# EAGLE design zero_3_2b4_c (EAGLE 4.16)
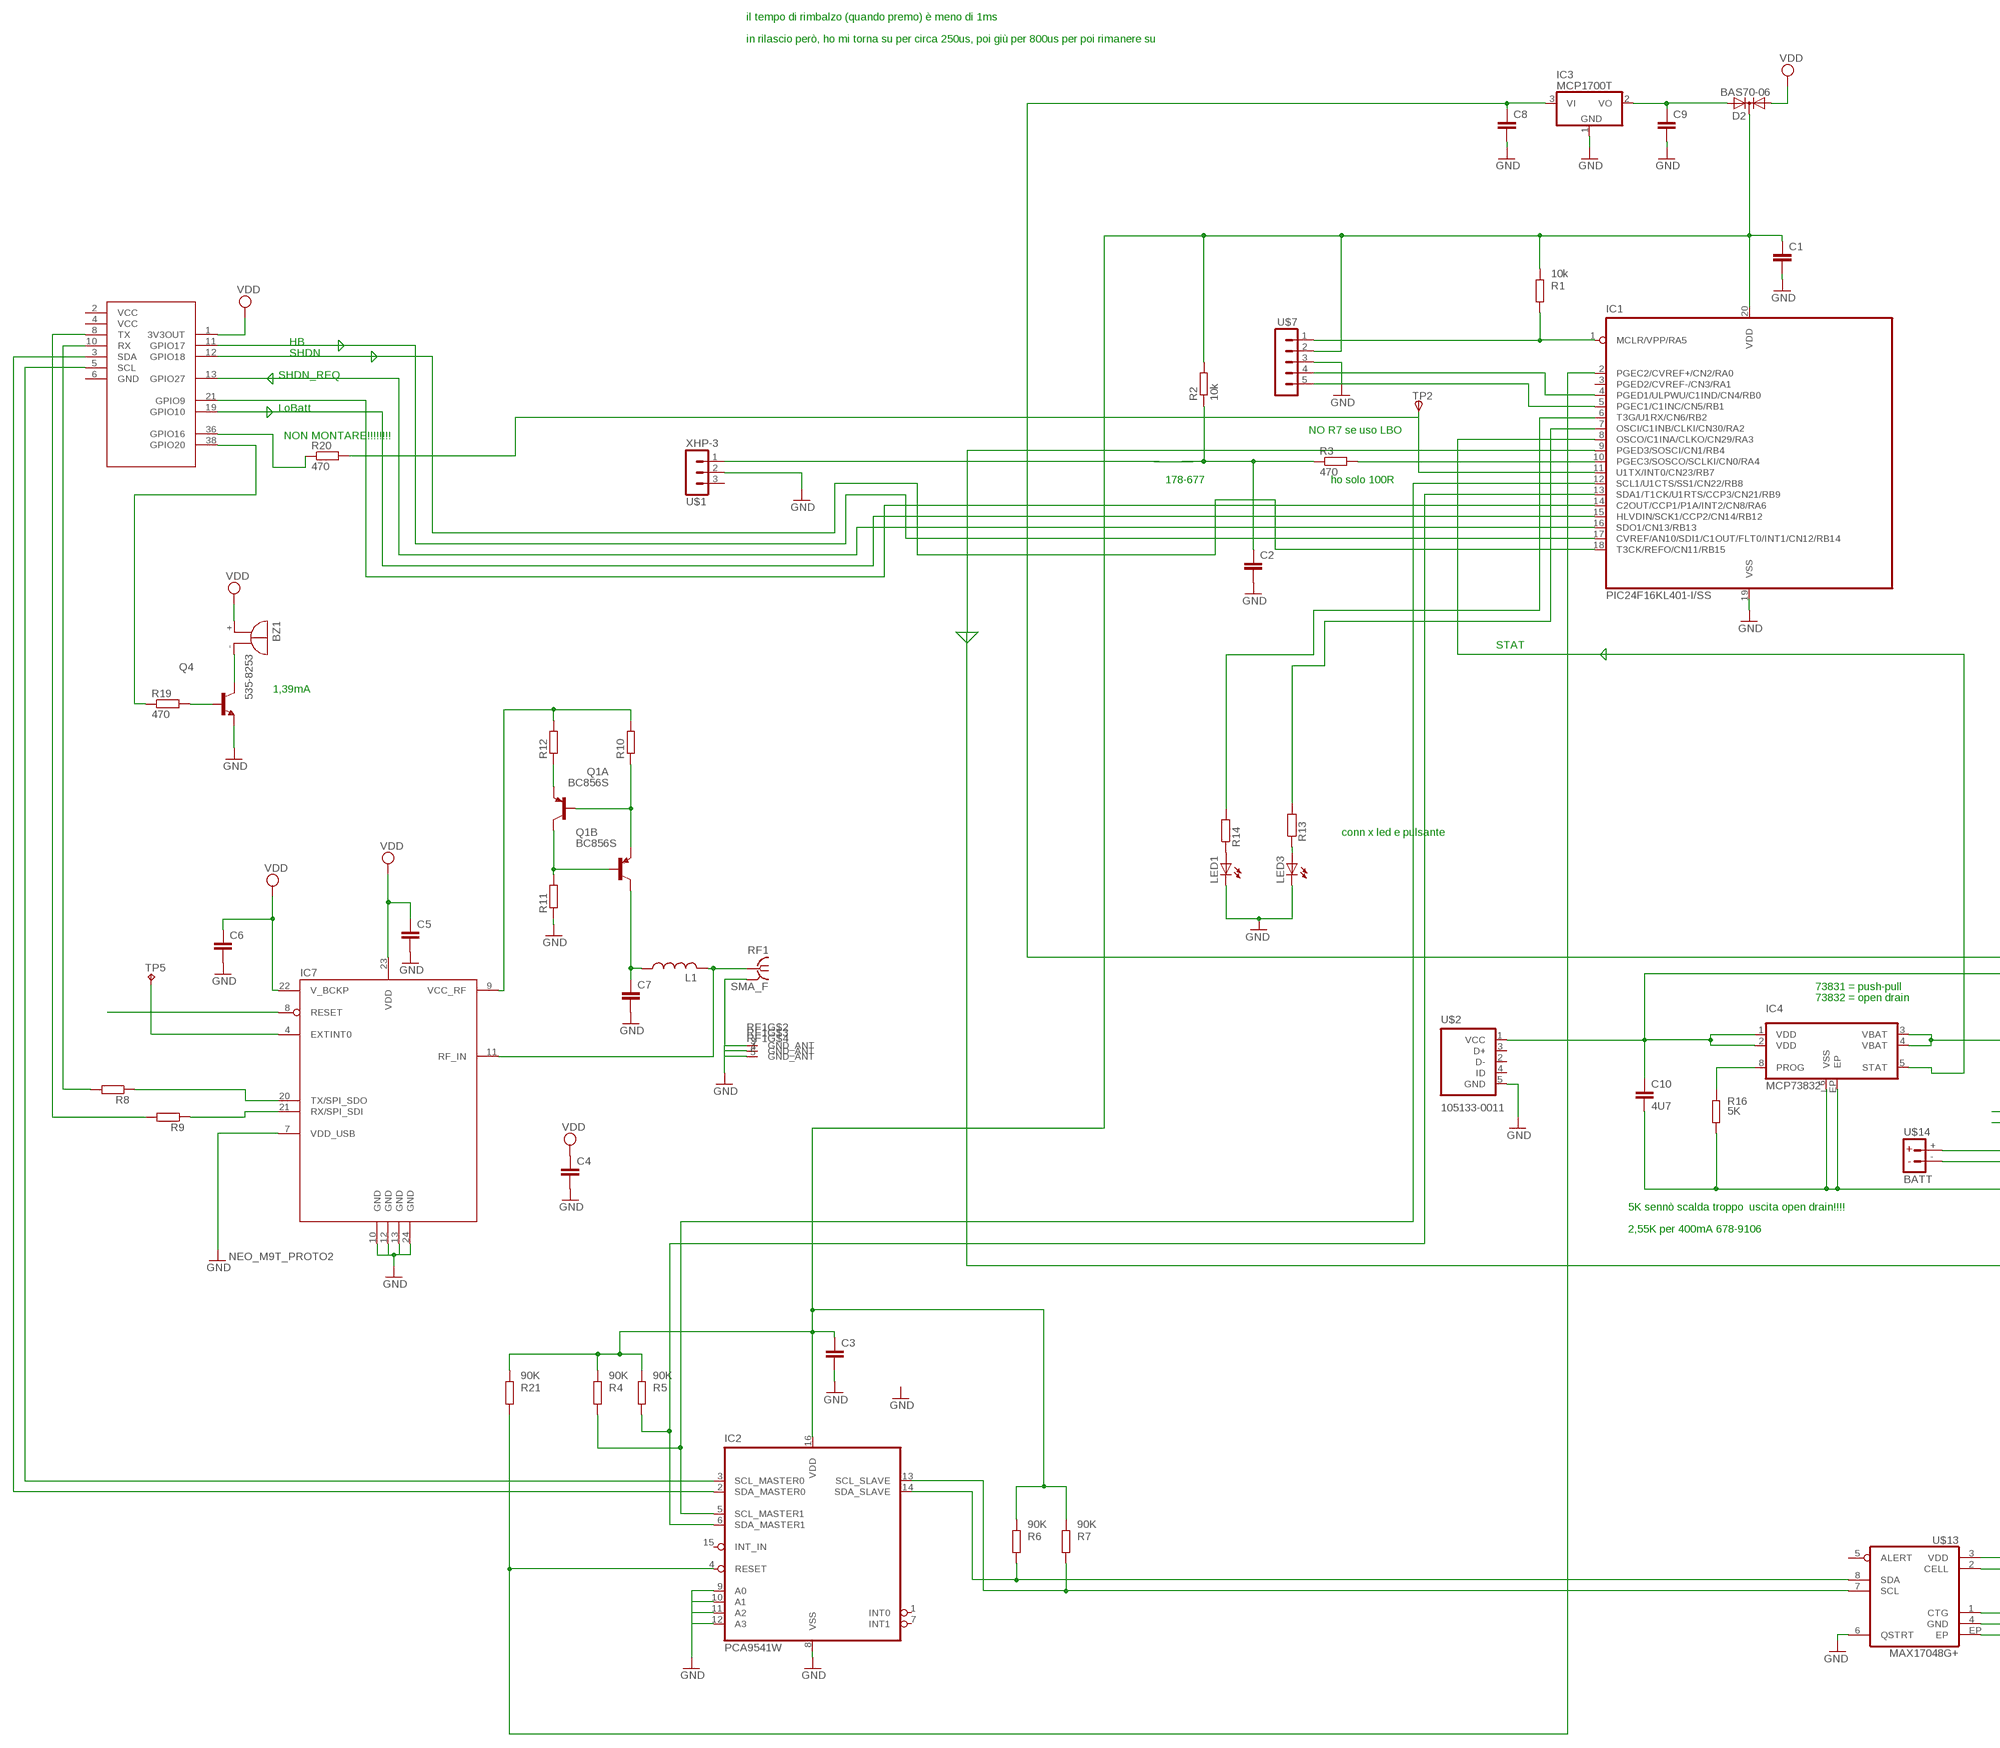
[diagram p0: schematic, sheet 1, part 1 of 2]
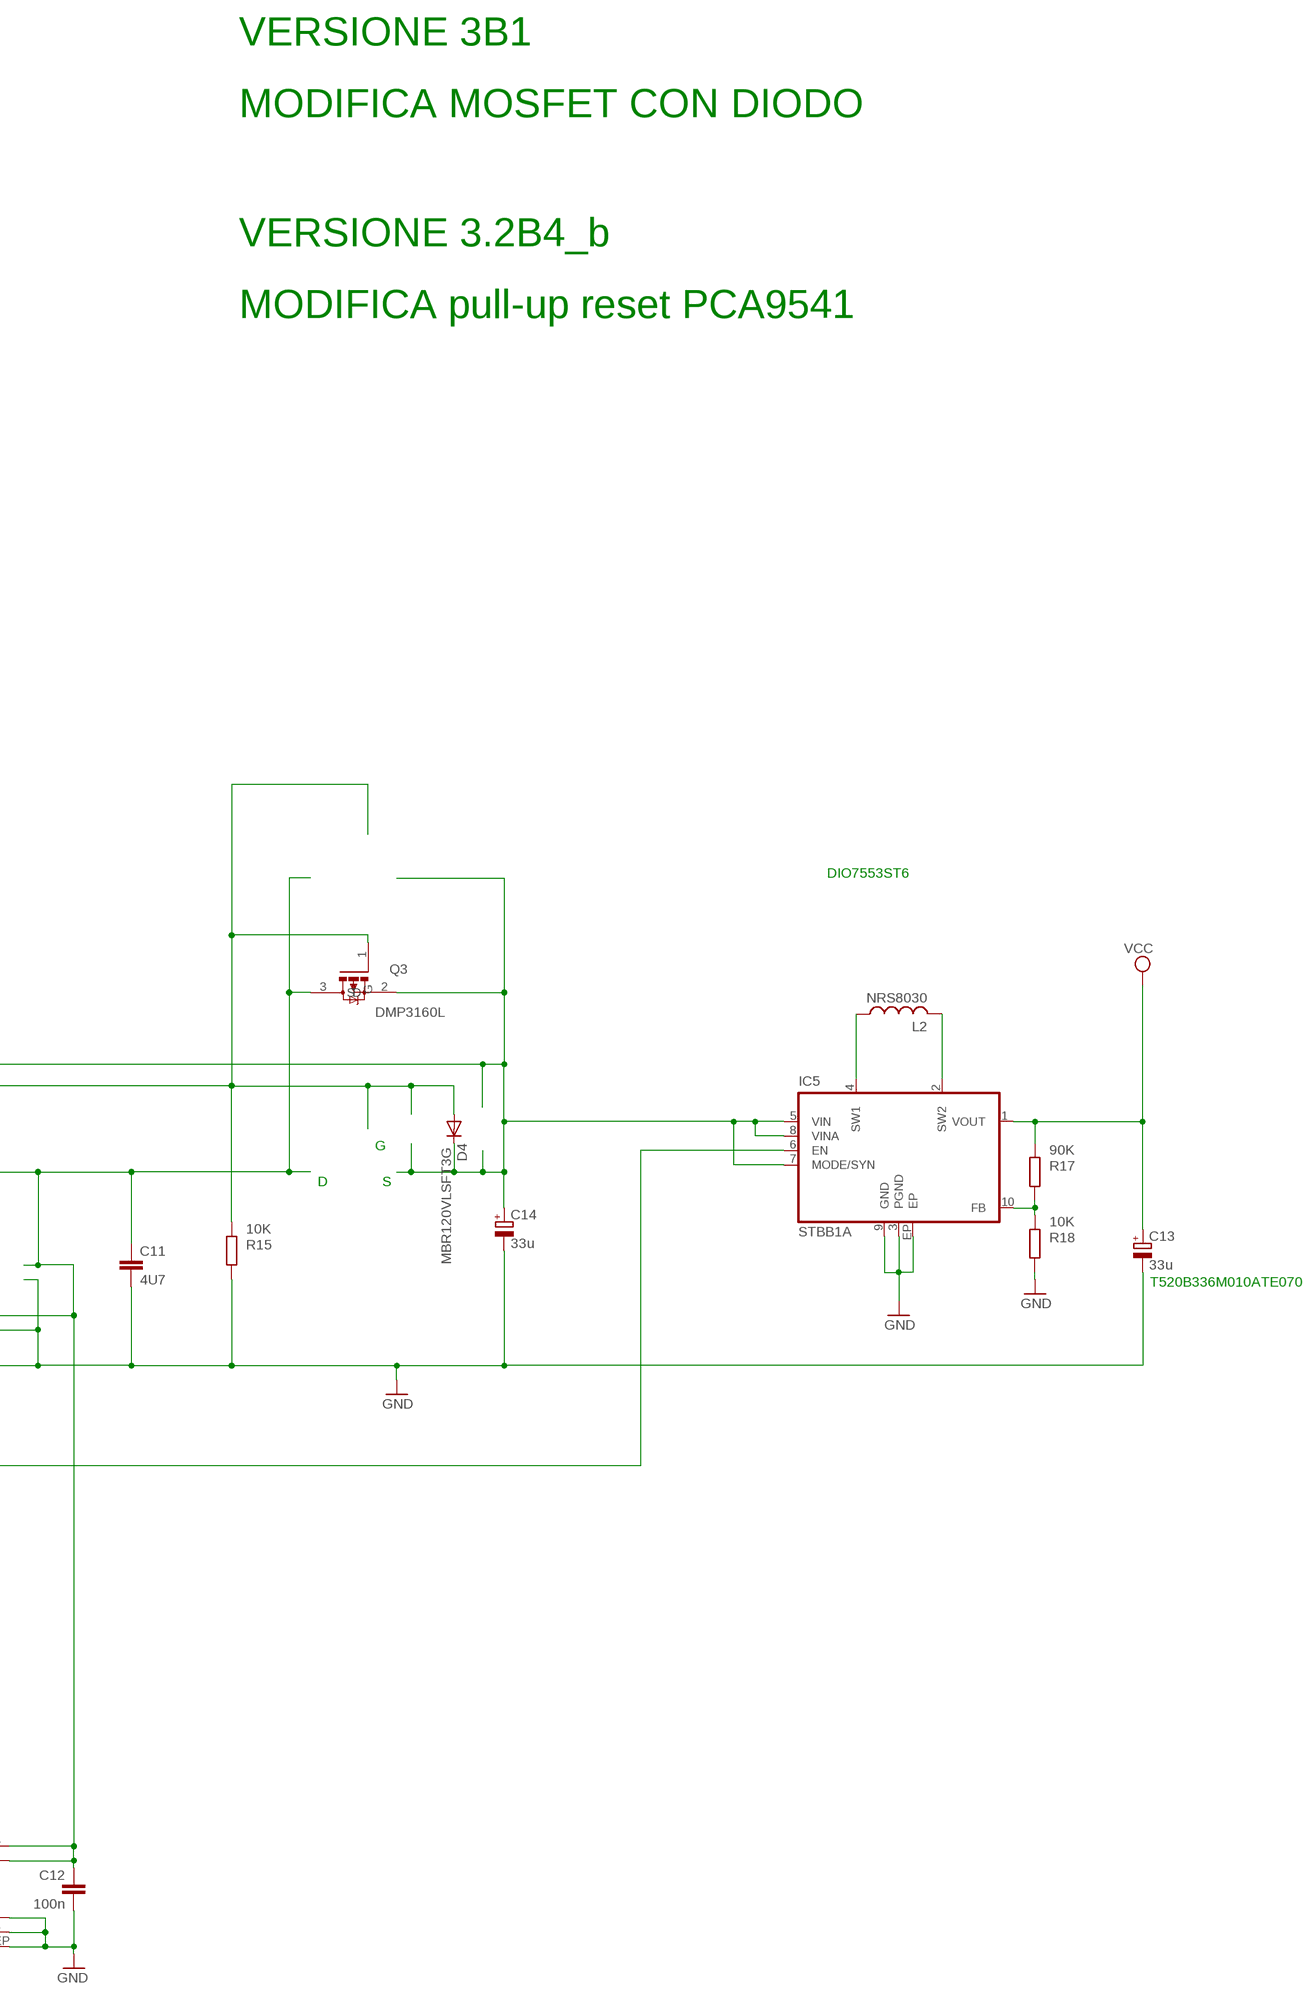
[diagram p1: schematic, sheet 1, part 2 of 2]

## Parts
BZ1  535-8253  [535-8253]
C1  C-EUC0402  [C0402]
C2  C-EUC0402  [C0402]
C3  C-EUC0402  [C0402]
C4  C-EUC1206  [C1206]
C5  C-EUC0402  [C0402]
C6  C-EUC0402  [C0402]
C7  C-EUC0402  [C0402]
C8  C-EUC0402  [C0402]
C9  C-EUC0402  [C0402]
C10  4U7  C-EUC0805  [C0805]
C11  4U7  C-EUC0805  [C0805]
C12  100n  C-EUC0402  [C0402]
C13  33u  CPOL-EUB/3528-21R  [B/3528-21R]
C14  33u  CPOL-EUB/3528-21R  [B/3528-21R]
D2  BAS70-06  [SOT23]
D4  MBR120VLSFT3G  DIODE-SOD123  [SOD123]
IC1  PIC24F16KL401-I/SS  PIC24F04KL101-I/SS  [SSOP20]
IC2  PCA9541W  [TSSOP16]
IC3  MCP1700T  [SOT23]
IC4  MCP73832_  MCP73831_  [DFN8]
IC5  STBB1A  [DFN-10]
IC7  NEO_M9T_PROTO2  [M8T_PROTO_3]
L1  L-US0402  [C0402]
L2  NRS8030  [NRS8030]
LED1  LEDPCB  [LED3MM_PCB]
LED3  LEDPCB  [LED3MM_PCB]
Q1  BC856S  [SOT-363]
Q3  DMP3160L  [SOT23]
Q4  -NPN-SOT23-EBC  [SOT23-EBC]
R1  10k  R-EU_R0402  [R0402]
R2  10k  R-EU_R0402  [R0402]
R3  470  R-EU_R0402  [R0402]
R4  90K  R-EU_R0402  [R0402]
R5  90K  R-EU_R0402  [R0402]
R6  90K  R-EU_R0402  [R0402]
R7  90K  R-EU_R0402  [R0402]
R8  R-EU_R0402  [R0402]
R9  R-EU_R0402  [R0402]
R10  R-EU_R0402  [R0402]
R11  R-EU_R0402  [R0402]
R12  R-EU_R0402  [R0402]
R13  R-EU_R0402  [R0402]
R14  R-EU_R0402  [R0402]
R15  10K  R-EU_R0402  [R0402]
R16  5K  R-EU_R0402  [R0402]
R17  90K  R-EU_R0402  [R0402]
R18  10K  R-EU_R0402  [R0402]
R19  470  R-EU_R0402  [R0402]
R20  470  R-EU_R0402  [R0402]
R21  90K  R-EU_R0402  [R0402]
RF1  SMA_F  [5-1814400-1]
TP2  TPSB1,27  [B1,27]
TP5  TPB1,27  [B1,27]
U$1  XHP-3  [B3B-XH]
U$2  105133-0011  [105133-0011]
U$7  MA05-1  [281695-5]
U$13  MAX17048G+  [TDFN8EP]
U$14  BATT  [XH]
ZW5  ZERO_7  [ZERO_7]

## Nets
GND: C1.2 C2.2 C3.2 C4.2 C5.2 C6.2 C7.2 C8.2 C9.2 C10.2 C11.2 C12.2 C13.- C14.- IC1.19(VSS) IC2.8(VSS) IC2.9(A0) IC2.10(A1) IC2.11(A2) IC2.12(A3) IC3.1(GND) IC4.6(VSS) IC4.EP IC5.3(PGND) IC5.9(GND) IC5.EP IC7.7(VDD_USB) IC7.10(GND) IC7.12(GND) IC7.13(GND) IC7.24(GND) LED1.K(C) LED3.K(C) Q4.E R11.1 R15.2 R16.2 R18.2 RF1.2(GND_ANT) RF1.3(GND_ANT) RF1.4(GND_ANT) RF1.5(GND_ANT) U$1.2 U$2.5(GND) U$7.3 U$13.1(CTG) U$13.4(GND) U$13.6(QSTRT) U$13.EP U$14.-
N$1: IC2.14(SDA_SLAVE) R6.2 U$13.8(SDA)
N$2: C8.1 C14.+ D4.C IC3.3(VI) IC5.5(VIN) IC5.7(MODE/SYN) IC5.8(VINA) Q3.2(S)
N$3: IC1.2(PGEC2/CVREF+/CN2/RA0) IC2.4(RESET) R21.2
N$4: R20.1 ZW5.36(GPIO16)
N$5: Q4.B R19.2
N$6: IC2.2(SDA_MASTER0) ZW5.3(SDA)
N$7: C9.1 D2.2(A2) IC3.2(VO)
N$8: IC1.4(PGED1/ULPWU/C1IND/CN4/RB0) U$7.4
N$10: IC2.3(SCL_MASTER0) ZW5.5(SCL)
N$11: IC1.11(U1TX/INT0/CN23/RB7) R20.2 TP2.PP
N$13: IC2.13(SCL_SLAVE) R7.2 U$13.7(SCL)
N$14: IC1.9(PGED3/SOSCI/CN1/RB4) IC5.6(EN)
N$15: IC1.1(MCLR/VPP/RA5) R1.2 U$7.1
N$17: R19.1 ZW5.38(GPIO20)
N$18: BZ1.- Q4.C
N$19: IC1.5(PGEC1/C1INC/CN5/RB1) U$7.5
N$23: IC1.17(CVREF/AN10/SDI1/C1OUT/FLT0/INT1/CN12/RB14) ZW5.11(GPIO17)
N$24: IC1.14(C2OUT/CCP1/P1A/INT2/CN8/RA6) ZW5.21(GPIO9)
N$25: IC1.15(HLVDIN/SCK1/CCP2/CN14/RB12) ZW5.19(GPIO10)
N$26: IC1.10(PGEC3/SOSCO/SCLKI/CN0/RA4) R3.2
N$27: IC1.12(SCL1/U1CTS/SS1/CN22/RB8) IC2.5(SCL_MASTER1) R4.2
N$28: C2.1 R2.1 R3.1 U$1.1
N$31: C11.1 C12.1 IC4.3(VBAT) IC4.4(VBAT) Q3.3(D) U$13.2(CELL) U$13.3(VDD) U$14.+
N$36: LED1.A R14.1
N$37: IC1.13(SDA1/T1CK/U1RTS/CCP3/CN21/RB9) IC2.6(SDA_MASTER1) R5.2
N$38: LED3.A R13.1
N$39: C1.1 C3.1 D2.3(C) IC1.20(VDD) IC2.16(VDD) R1.1 R2.2 R4.1 R5.1 R6.1 R7.1 R21.1 U$7.2
N$40: IC1.8(OSCO/C1INA/CLKO/CN29/RA3) IC4.5(STAT)
N$41: IC1.7(OSCI/C1INB/CLKI/CN30/RA2) R13.2
N$49: IC5.10(FB) R17.2 R18.1
N$51: IC1.6(T3G/U1RX/CN6/RB2) R14.2
N$61: IC5.2(SW2) L2.2
N$62: IC5.4(SW1) L2.1
N$66: IC7.11(RF_IN) L1.2 RF1.1
N$67: C7.1 L1.1 Q1.3(B:C)
N$68: Q1.2(A:B) Q1.4(B:E) R10.1
N$69: Q1.5(B:B) Q1.6(A:C) R11.2
N$70: Q1.1(A:E) R12.1
N$71: IC7.4(EXTINT0) TP5.PP(TP)
N$72: IC7.8(RESET)
N$73: IC7.21(RX/SPI_SDI) R9.1
N$74: IC7.20(TX/SPI_SDO) R8.1
N$75: IC7.9(VCC_RF) R10.2 R12.2
N$76: R8.2 ZW5.10(RX)
N$77: R9.2 ZW5.8(TX)
N$80: IC1.16(SDO1/CN13/RB13) ZW5.13(GPIO27)
N$81: IC1.18(T3CK/REFO/CN11/RB15) ZW5.12(GPIO18)
N$82: IC4.8(PROG) R16.1
N$83: C10.1 D4.A IC4.1(VDD) IC4.2(VDD) Q3.1(G) R15.1 U$2.1(VCC)
VCC: C13.+ IC5.1(VOUT) R17.1
VDD: BZ1.+ C4.1 C5.1 C6.1 D2.1(A1) IC7.22(V_BCKP) IC7.23(VDD) ZW5.1(3V3OUT)
Unconnected: IC1.3(PGED2/CVREF-/CN3/RA1) IC2.1(INT0) IC2.7(INT1) IC2.15(INT_IN) U$1.3 U$2.2(D-) U$13.5(ALERT)

## Notes on the sheet
- il tempo di rimbalzo (quando premo) è meno di 1ms
- in rilascio però, ho mi torna su per circa 250us, poi giù per 800us per poi rimanere su
- VERSIONE 3B1
- MODIFICA MOSFET CON DIODO
- VERSIONE 3.2B4_b
- HB
- SHDN
- SHDN_REQ
- MODIFICA pull-up reset PCA9541
- LoBatt
- NO R7 se uso LBO
- NON MONTARE!!!!!!!!
- 178-677 | ho solo 100R
- STAT
- 1,39mA
- DIO7553ST6
- conn x led e pulsante
- 73831 = push-pull
- 73832 = open drain
- G
- D | S
- T520B336M010ATE070
- 5K sennò scalda troppo | uscita open drain!!!!
- 2,55K per 400mA 678-9106

## Power pins joined to a net without a drawn wire
D+: U$2.3(D+)
GND: ZW5.6(GND)
GND_ANT: U$2.S1(GND_ANT) U$2.S2(GND_ANT) U$2.S3(GND_ANT)
ID: U$2.4(ID)
VCC: ZW5.2(VCC) ZW5.4(VCC)

## Library data of the parts
BZ1 = buzzer:535-8253
C1-C12 = 000001:C-EU: CAPACITOR, European symbol
C13 C14 = 000001:CPOL-EU: POLARIZED CAPACITOR, European symbol
D2 = diode:BAS70-06: Silicon Schottky Diodes General-purpose diode for high-speed switching
D4 = diode:DIODE-: DIODE
IC1 = microchip:PIC24F04KL101
IC2 = nxp:PCA9541
IC3 = 000001:MCP1700
IC4 = microchip:MCP73831_
IC5 = st:STBB1A
IC7 = ublox:NEO_M9T_PROTO2
L1 = 000001:L-US: INDUCTOR, American symbol
L2 = Taiyo:NRS8030
LED1 LED3 = 000001:LED: LED OSRAM: - CHIPLED LG R971, LG N971, LY N971, LG Q971, LY Q971, LO R971, LY R971 LH N974, LH R974 LS Q976, LO Q976, LY Q976 LO Q996 - Hyper CHIPLED LW Q18S LB Q993, LB Q99A, LB R99A - SideLED LS A670, LO A670, LY A670, LG A670, LP A670 LB A673, LV A673, LT A673, LW A673 LH A674 LY A675 LS A676, LA A676, LO A676, LY A676, LW A676 LS A679, LY A679, LG A679 - Hyper Micro SIDELED® LS Y876, LA Y876, LO Y876, LY Y876 LT Y87S - SmartLED LW L88C, LW L88S LB L89C, LB L89S, LG L890 LS L89K, LO L89K, LY L89K LS L896, LA L896, LO L896, LY L896 - TOPLED LS T670, LO T670, LY T670, LG T670, LP T670 LSG T670, LSP T670, LSY T670, LOP T670, LYG T670 LG T671, LOG T671, LSG T671 LB T673, LV T673, LT T673, LW T673 LH T674 LS T676, LA T676, LO T676, LY T676, LB T676, LH T676, LSB T676, LW T676 LB T67C, LV T67C, LT T67C, LS T67K, LO T67K, LY T67K, LW E67C LS E67B, LA E67B, LO E67B, LY E67B, LB E67C, LV E67C, LT E67C LW T67C LS T679, LY T679, LG T679 LS T770, LO T770, LY T770, LG T770, LP T770 LB T773, LV T773, LT T773, LW T773 LH T774 LS E675, LA E675, LY E675, LS T675 LS T776, LA T776, LO T776, LY T776, LB T776 LHGB T686 LT T68C, LB T68C - Hyper Mini TOPLED® LB M676 - Mini TOPLED Santana® LG M470 LS M47K, LO M47K, LY M47K Source: http://www.osram.convergy.de/
Q1 = transistor:BC856
Q3 = zetex:DMP3160
Q4 = transistor:*-NPN-: NPN Transistror
R1-R21 = 000001:R-EU_: RESISTOR, European symbol
RF1 = te:SMA_F
TP2 = testpad:TPS: TEST PIN
TP5 = testpad:TP
U$1 = JST:XHP-3
U$2 = molex:105133-0011
U$7 = te:MA05-1
U$13 = maxim:MAX17048
U$14 = JST:BATT
ZW5 = raspberry_pi:ZERO_7

## Board
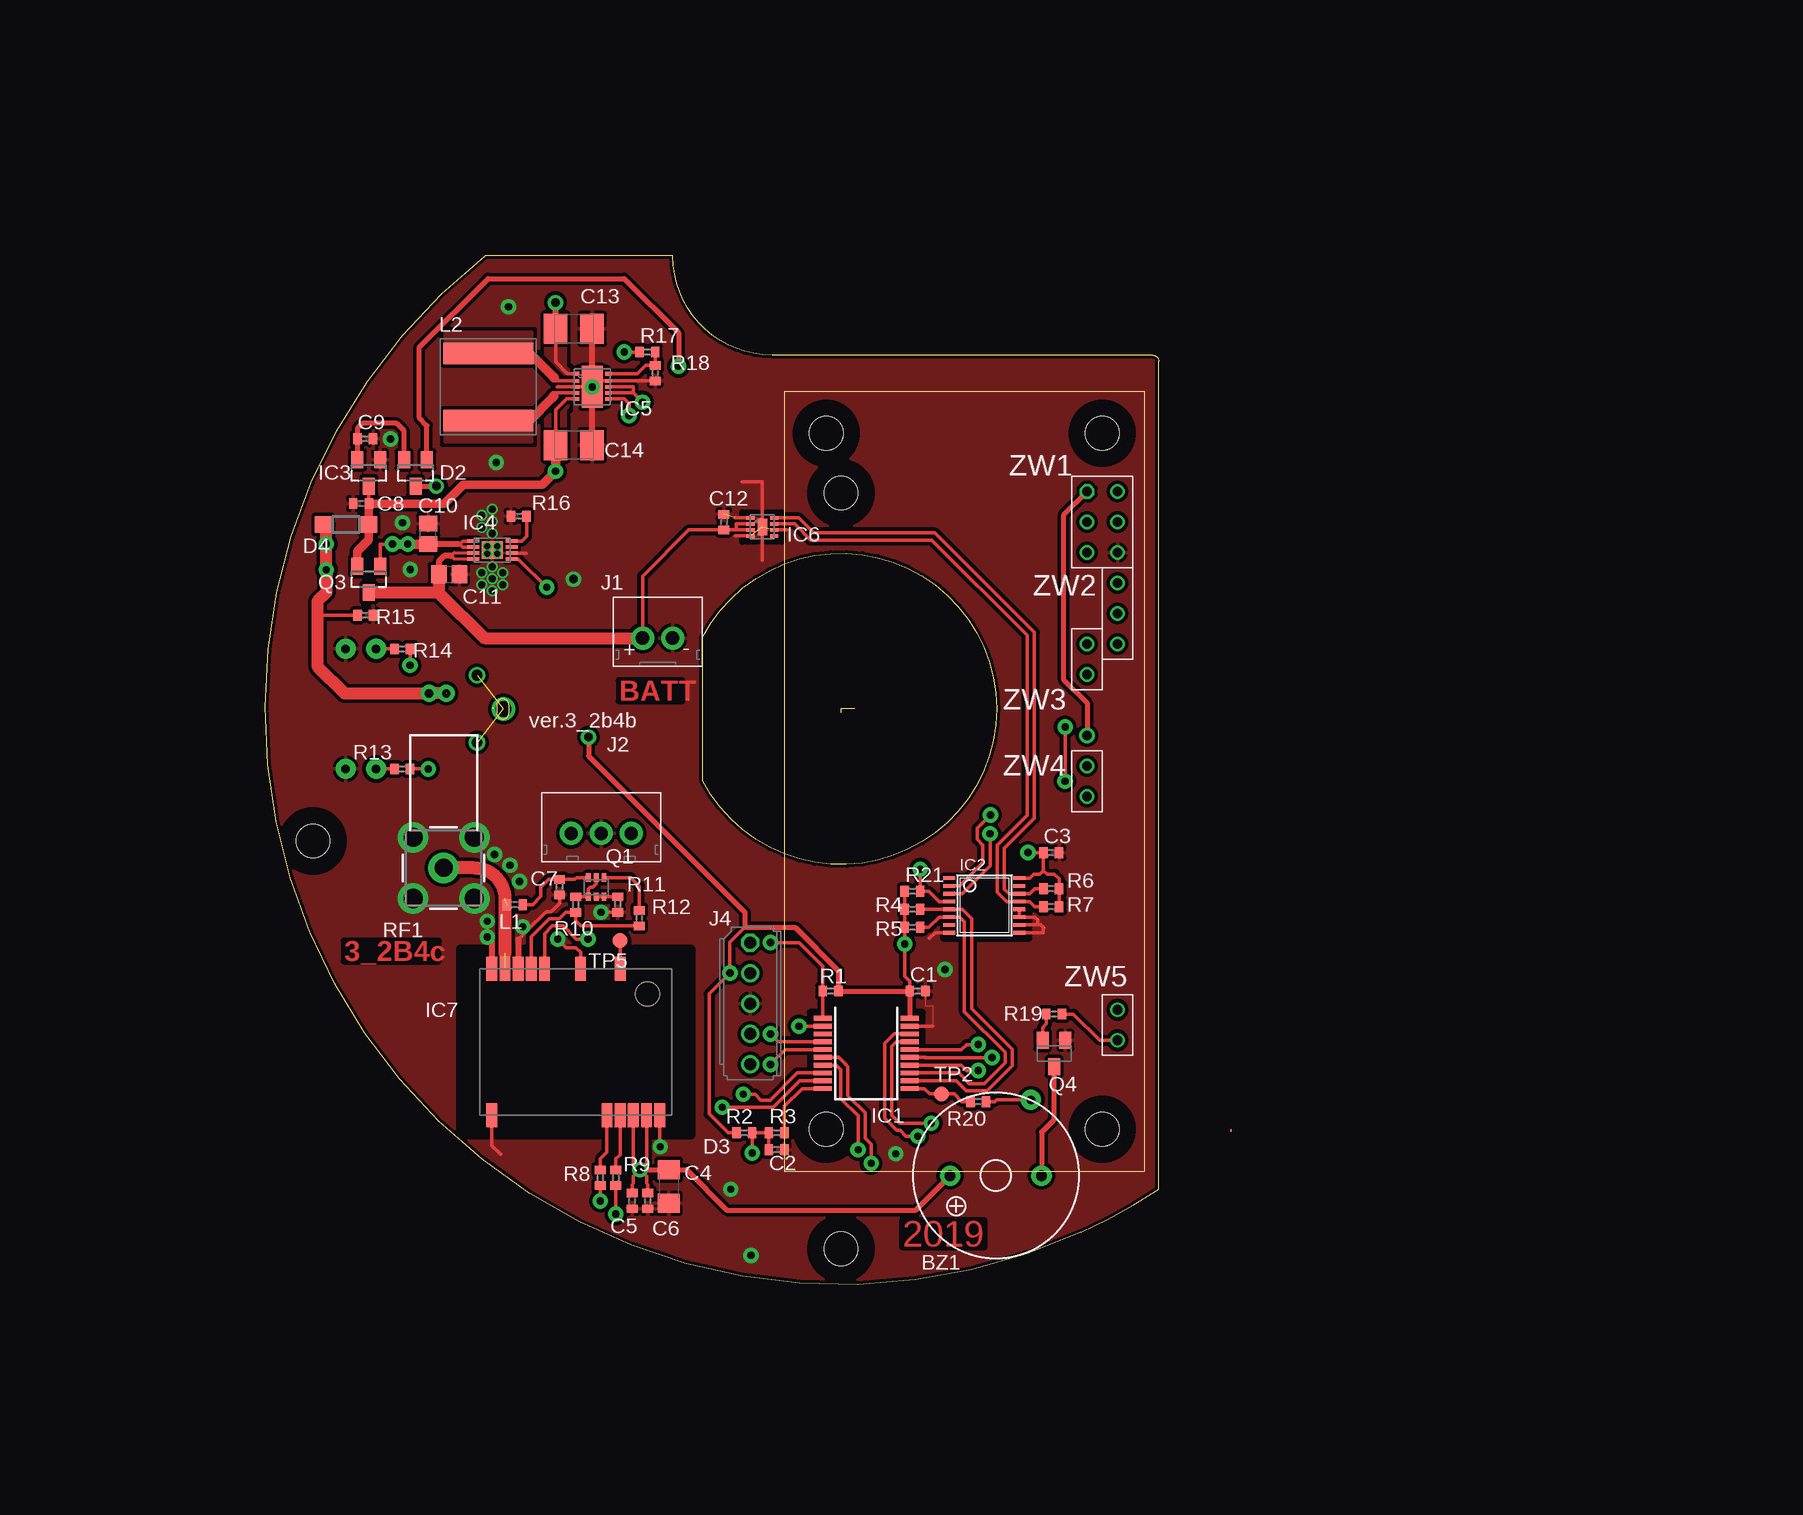
[diagram p2: board, top side]
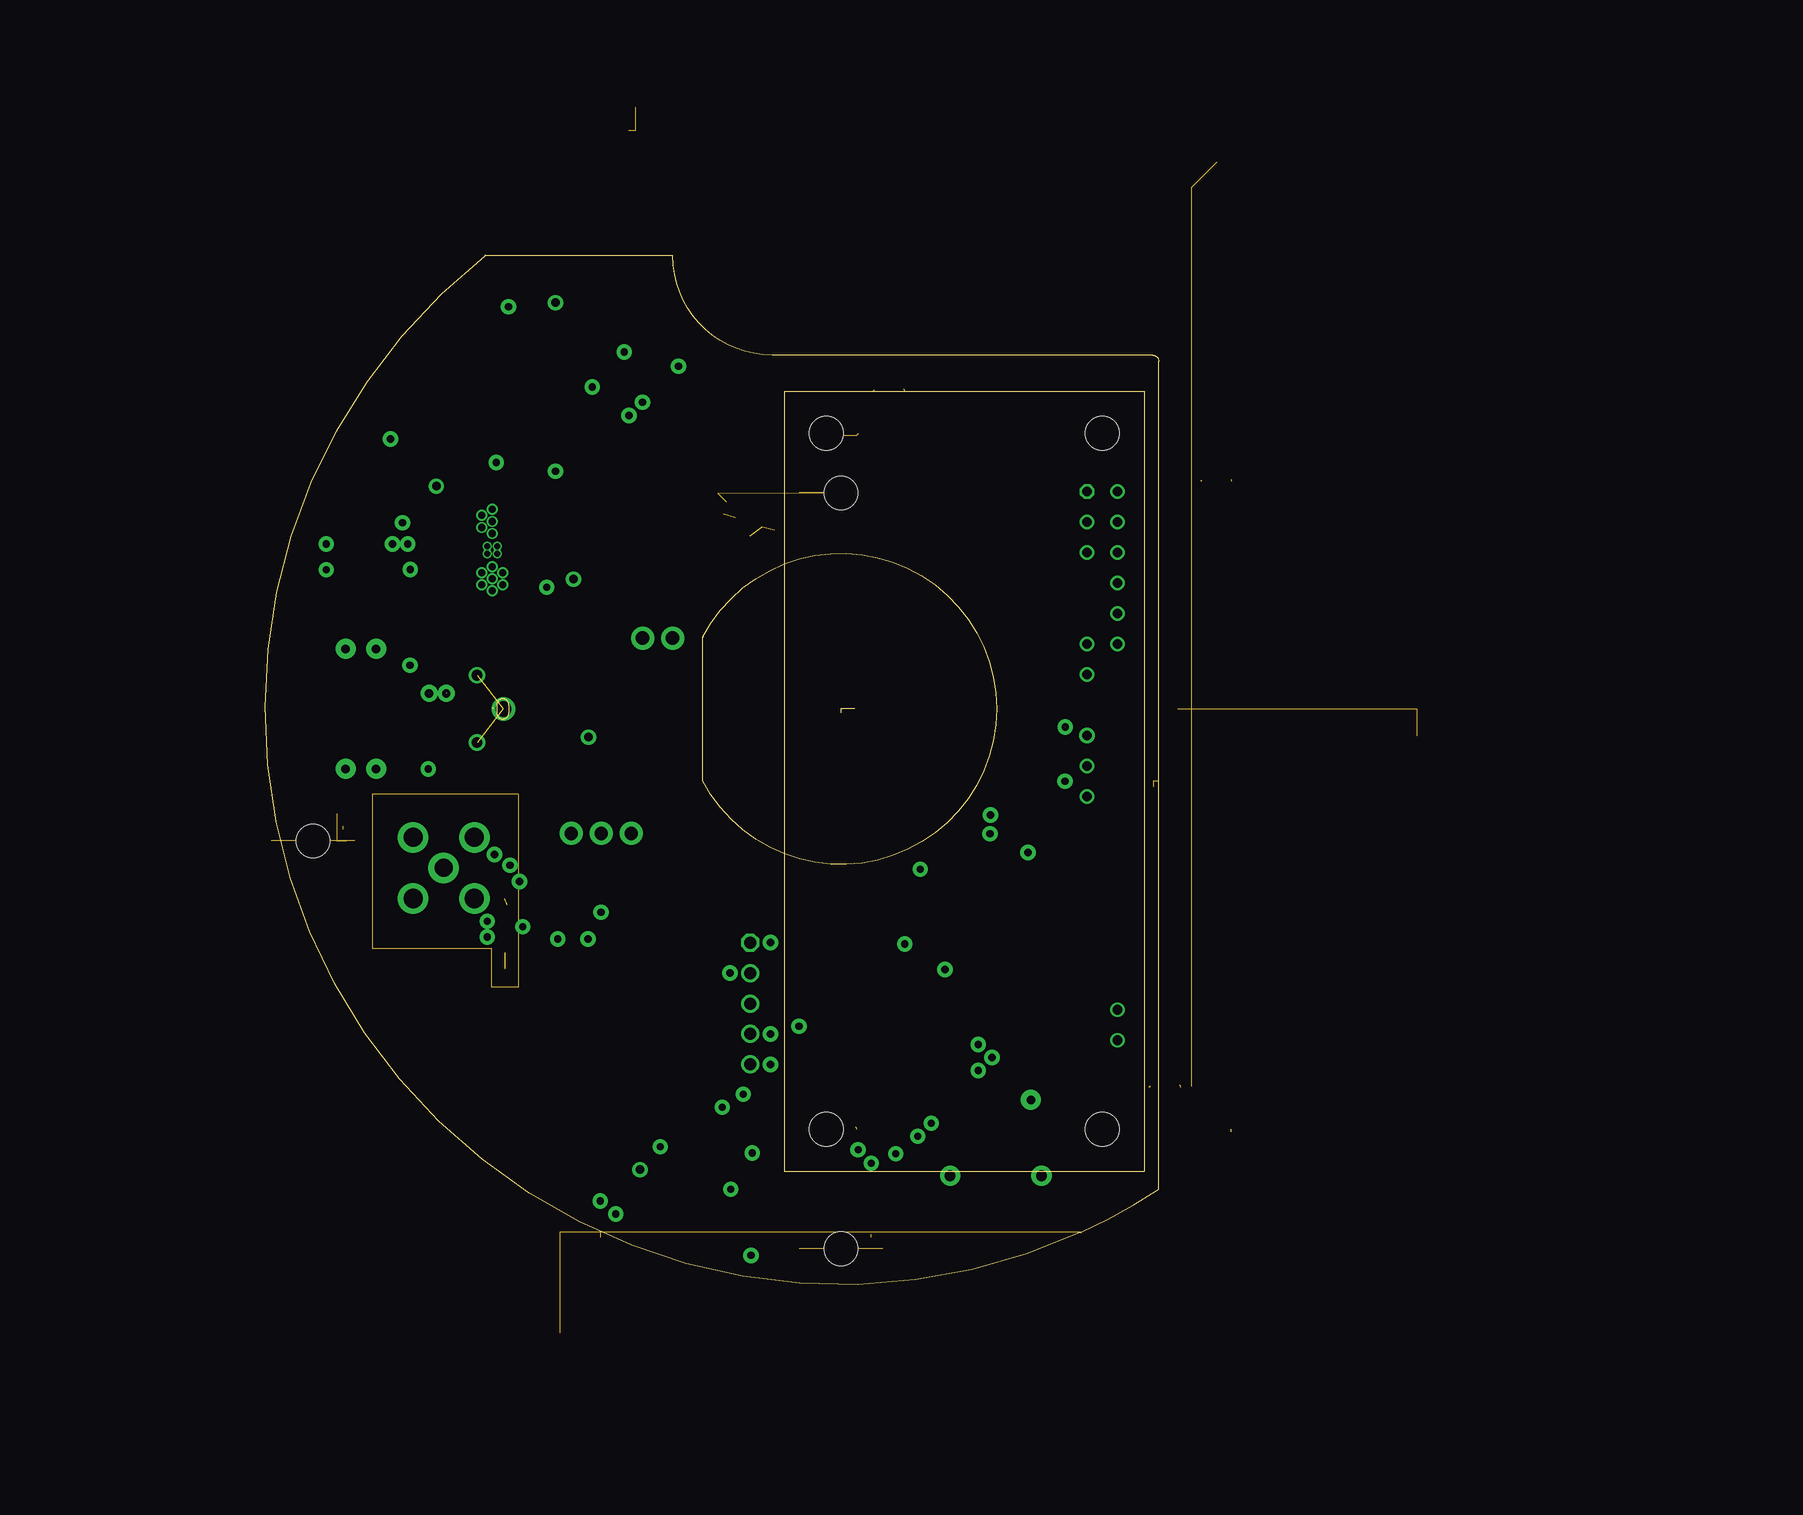
[diagram p3: board, inner layer Route5]
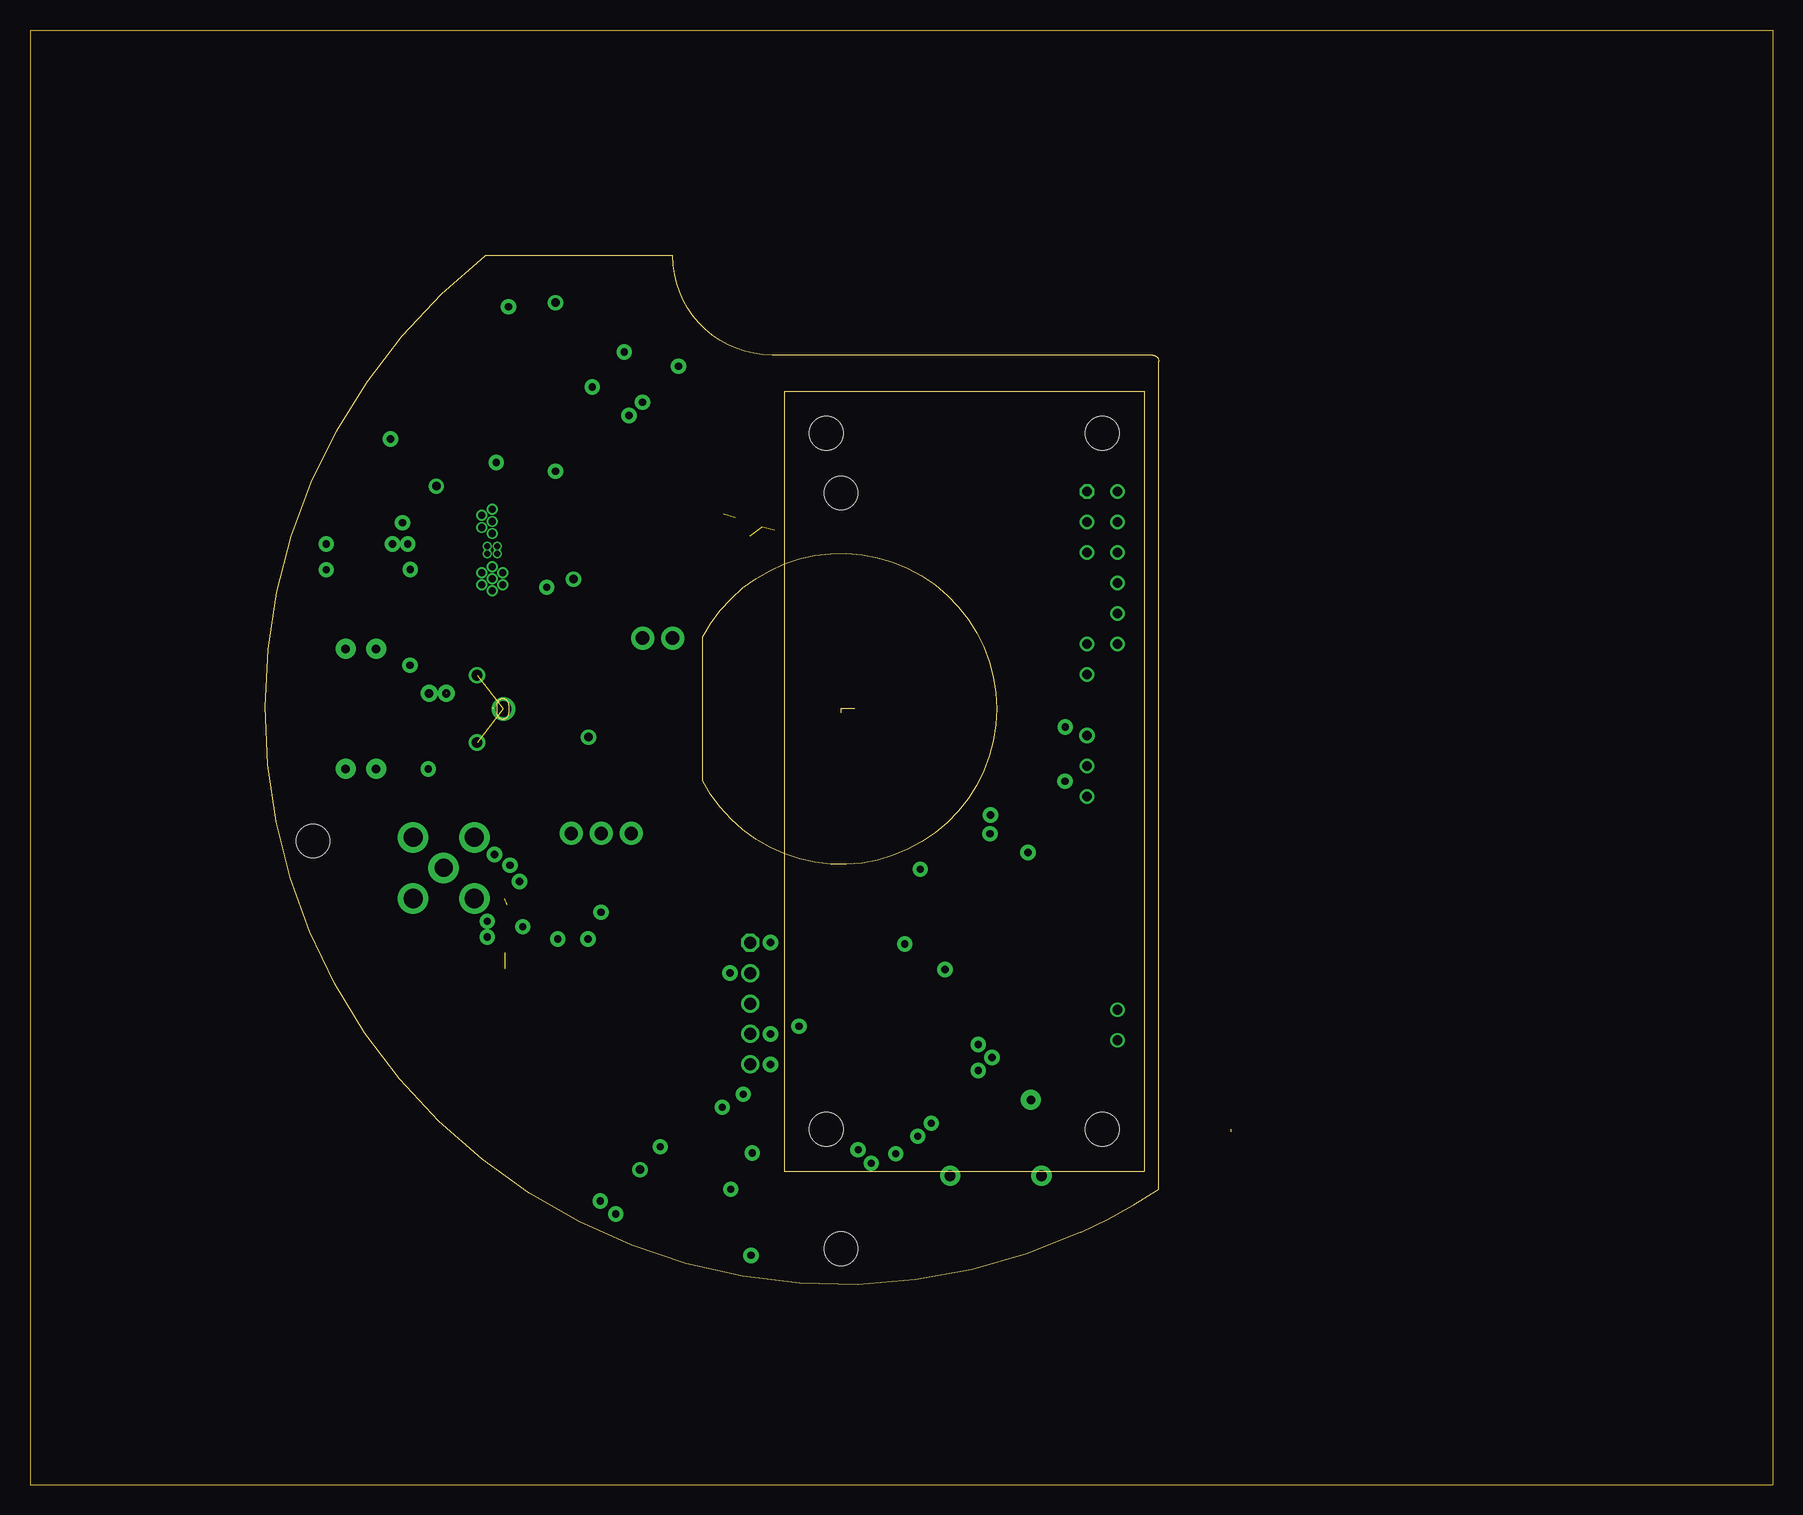
[diagram p4: board, inner layer Route6]
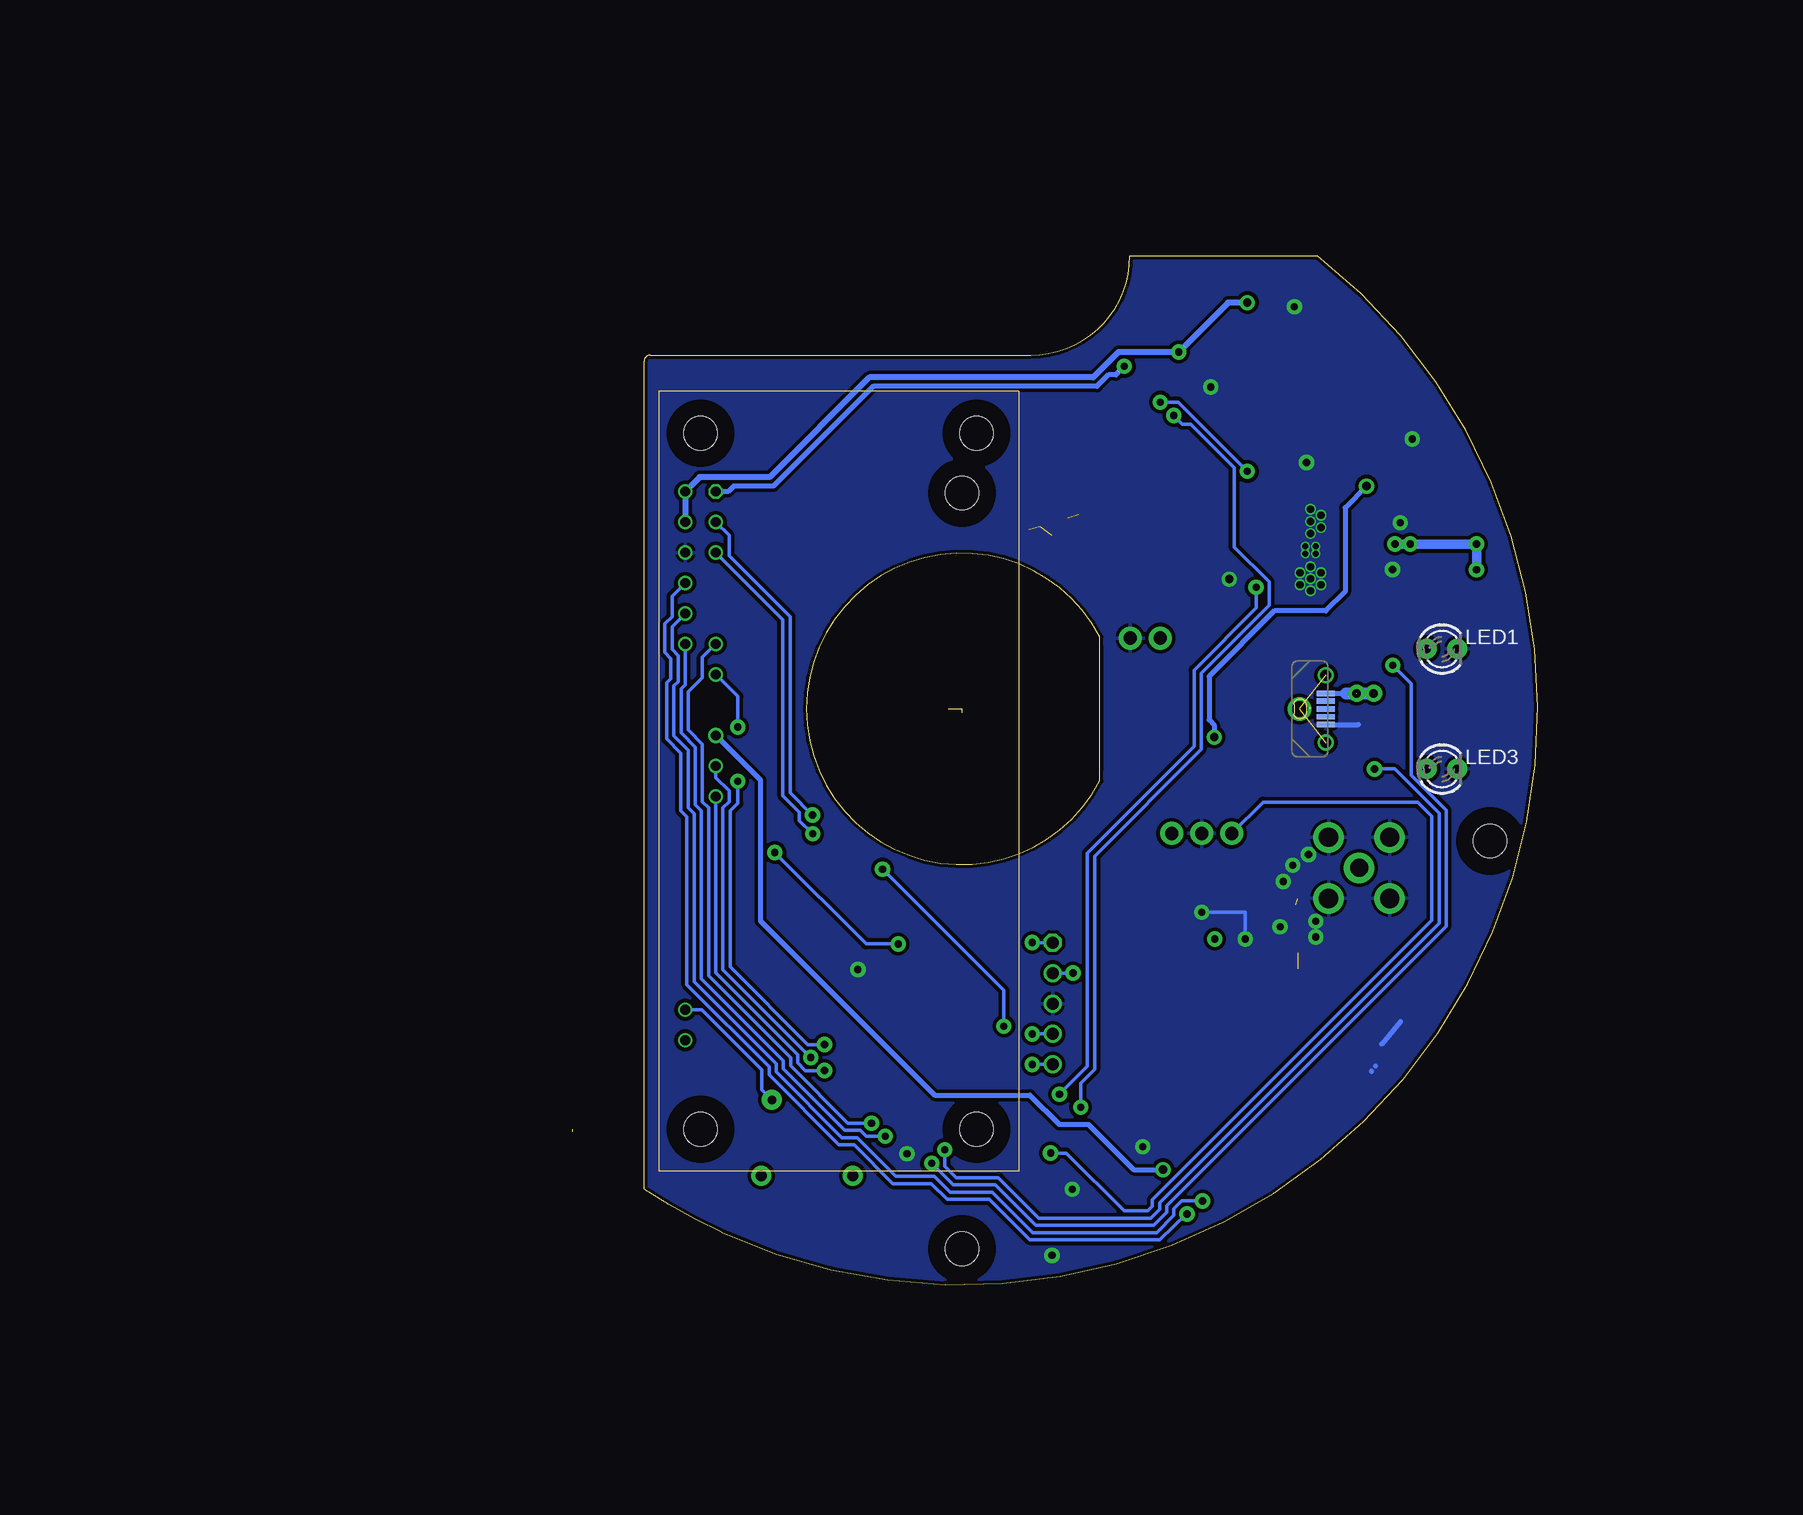
[diagram p5: board, bottom side, seen from below]

Size 74.48 x 85.72 mm. Coordinates in mm from the lower left corner, seen from the top.
Outline: 36.49,53.97 arc-305 36.49,41.97 36.49,53.97
Outline: 33.99,85.72 18.36,85.72 arc167 67.99,4.35 arc9 74.48,7.95 74.48,76.95 arc90 73.98,77.45 42.26,77.45 arc-90 33.99,85.72
Copper layers (1*16): Top 0.035mm / dielectric 1.5mm / Bottom 0.035mm
Design rules "default": minimum track width 0.1mm, minimum drill 24mil, track to track 8mil, track to pad 8mil, pad to pad 8mil, via to via 8mil, smd to smd 8mil, copper to edge 0.02mm, drill to drill 8mil, minimum pad ring 1mil, minimum via ring 1mil, stop-mask expansion 0.3mm, vias tented up to drill 0mil, thermal gap 10mil
Holes 2.8 mm at 46.78,70.95 46.78,12.95 69.78,70.95 69.78,12.95 46.78,70.95 47.99,65.97 3.99,36.97 47.99,2.98
tRestrict: area 16.2,12.4 to 35.6,28; area 67.3,10.5 to 72.3,15.5; area 44.3,10.5 to 49.3,15.5; area 44.3,68.5 to 49.3,73.5; area 67.3,68.5 to 72.3,73.5; area 45.5,63.5 to 50.5,68.5; area 1.5,34.5 to 6.5,39.5; area 45.5,0.5 to 50.5,5.5; area 45.4,15.8 to 54.8,22.7; area 56.5,28.9 to 63.7,34; area 28,75.7 to 28.5,76.4; area 27.9,73.2 to 28.5,73.6; area 26,76 to 26.6,76.3; 7 lines
bRestrict: area 44.3,68.5 to 49.3,73.5; area 67.3,68.5 to 72.3,73.5; area 67.3,10.5 to 72.3,15.5; area 44.3,10.5 to 49.3,15.5; area 45.5,63.5 to 50.5,68.5; area 1.5,34.5 to 6.5,39.5; area 45.5,0.5 to 50.5,5.5; 1 lines
vRestrict: 308 lines
Milling: 2 lines

### Footprints (pad centres in the part's own frame; a part is rotated, then mirrored left to right if it is on the bottom)
535-8253 = drill 0.9 pad 1.676 round: + 3.81,0; - -3.81,0
C0402 = smd 0.7 x 0.9: 1 -0.65,0; 2 0.65,0
C1206 = smd 1.6 x 1.8: 1 -1.4,0; 2 1.4,0
C0805 = smd 1.3 x 1.5: 1 -0.85,0; 2 0.85,0
B/3528-21R = smd 1.95 x 2.5: + 1.525,0; - -1.525,0
SOT23 = smd 1 x 1.4: 1 -0.95,-1.1; 2 0.95,-1.1; 3 0,1.1
SOD123 = smd 1.4 x 1.4: A 1.9,0; C -1.9,0
SSOP20 = smd 1.5 x 0.4: 1 -3.625,2.925; 2 -3.625,2.275; 3 -3.625,1.625; 4 -3.625,0.975; 5 -3.625,0.325; 6 -3.625,-0.325; 7 -3.625,-0.975; 8 -3.625,-1.625; 9 -3.625,-2.275; 10 -3.625,-2.925; 11 3.625,-2.925; 12 3.625,-2.275; 13 3.625,-1.625; 14 3.625,-0.975; 15 3.625,-0.325; 16 3.625,0.325; 17 3.625,0.975; 18 3.625,1.625; 19 3.625,2.275; 20 3.625,2.925
TSSOP16 = smd 0.991 x 0.305: 1 -2.918,2.275; 2 -2.918,1.625; 3 -2.918,0.975; 4 -2.918,0.325; 5 -2.918,-0.325; 6 -2.918,-0.975; 7 -2.918,-1.625; 8 -2.918,-2.275; 9 2.918,-2.275; 10 2.918,-1.625; 11 2.918,-0.975; 12 2.918,-0.325; 13 2.918,0.325; 14 2.918,0.975; 15 2.918,1.625; 16 2.918,2.275
DFN8 = smd 1 x 0.3: 1 -1.6,0.75; 2 -1.6,0.25; 3 -1.6,-0.25; 4 -1.6,-0.75; 5 1.6,-0.75; 6 1.6,-0.25; 7 1.6,0.25; 8 1.6,0.75 | smd 1.75 x 1.45: EP 0,0
DFN-10 = smd 0.5 x 0.3: 1 -1.325,1.1; 2 -1.325,0.5; 3 -1.325,0; 4 -1.325,-0.5; 5 -1.325,-1; 6 1.325,-1; 7 1.325,-0.5; 8 1.325,0; 9 1.325,0.5; 10 1.325,1.1 | smd 1.75 x 3.5: EP 0,0
M8T_PROTO_3 = smd 0.9 x 2: 4 -3.7,-6.1; 7 -0.4,-6.1; 8 2.6,-6.1; 9 3.7,-6.1; 10 4.8,-6.1; 11 5.9,-6.1; 12 7,-6.1; 13 7,6.1; 20 -2.6,6.1; 21 -3.7,6.1; 22 -4.8,6.1; 23 -5.9,6.1; 24 -7,6.1
NRS8030 = smd 1.8 x 7.5: 1 -2.8,0; 2 2.8,0
LED3MM_PCB = drill 0.7 pad 1.676 round: A -1.27,0; K 1.27,0
SOT-363 = smd 0.4 x 0.7: 1 -0.65,-0.8; 2 0,-0.8; 3 0.65,-0.8; 4 0.65,0.8; 5 0,0.8; 6 -0.65,0.8
SOT23-EBC = smd 1 x 1.4: B 0.95,-1.1; C 0,1.1; E -0.95,-1.1
R0402 = smd 0.7 x 0.9: 1 -0.65,0; 2 0.65,0
5-1814400-1 = drill 1.5 pad 2.54 round: 1 0,0 | drill 1.6 pad 2.54 round: 2 -2.55,2.55; 3 2.55,2.55; 4 2.55,-2.55; 5 -2.55,-2.55
B1,27 = smd 1.27 x 1.27: PP 0,0
B3B-XH = drill 1.1 pad 1.93 round: 1 -2.5,0; 2 0,0; 3 2.5,0
105133-0011 = smd 0.45 x 1.5: 1 -1.3,1.325; 2 -0.65,1.325; 3 0,1.325; 4 0.65,1.325; 5 1.3,1.325 | drill 0.9 round: S1 -2.8,1.325; S2 2.8,1.325 | drill 1.3 pad 1.93 round: S3 0,-0.875
281695-5 = drill 1 octagon: 1 -5.08,0 | drill 1 round: 2 -2.54,0; 3 0,0; 4 2.54,0; 5 5.08,0
TDFN8EP = smd 0.7 x 0.3: 1 -0.99,0.75; 2 -0.99,0.25; 3 -0.99,-0.25; 4 -0.99,-0.75; 5 0.99,-0.75; 6 0.99,-0.25; 7 0.99,0.25; 8 0.99,0.75 | smd 0.8 x 1.38: EP 0,0
XH = drill 1.1 pad 1.93 round: + -1.25,0; - 1.25,0
ZERO_7 = drill 0.8 octagon: 1 -1.27,24.13 | drill 0.8 round: 2 1.27,24.13; 3 -1.27,21.59; 4 1.27,21.59; 5 -1.27,19.05; 6 1.27,19.05; 8 1.27,16.51; 10 1.27,13.97; 11 -1.27,11.43; 12 1.27,11.43; 13 -1.27,8.89; 19 -1.27,1.27; 21 -1.27,-1.27; 36 1.27,-19.05; 38 1.27,-21.59

### Placement (x,y rotation side)
BZ1  60.9,9.08 180 top
C1  54.38,24.46 0 top
C2  42.63,11.25 0 top
C3  65.52,36 0 top
C4  33.64,8.17 270 top
C5  30.59,6.97 270 top
C6  31.89,6.97 270 top
C7  24.54,33.12 270 top
C8  8,65.09 180 top
C9  8.35,70.49 0 top
C10  13.59,62.56 90 top
C11  15.34,59.2 0 top
C12  38.24,63.53 90 top
C13  25.74,79.64 180 top
C14  25.74,69.96 180 top
D2  12.55,67.64 180 top
D4  6.75,63.34 180 top
IC1  50.11,19.26 0 top
IC2  59.95,31.6 0 top
IC3  8.65,67.64 180 top
IC4  18.94,61.21 0 top
IC5  27.26,74.8 0 top
IC7  25.89,20.22 180 top
L1  20.83,31.66 180 top
L2  18.62,74.8 90 top
LED1  7.99,52.97 0 bottom
LED3  7.99,42.97 0 bottom
Q1  27.59,33.12 180 top
Q3  8.65,58.77 180 top
Q4  65.76,19.26 180 top
R1  47.13,24.46 180 top
R2  39.95,12.65 180 top
R3  42.63,12.65 0 top
R4  53.96,31.27 0 top
R5  53.96,29.77 0 top
R6  65.52,33 180 top
R7  65.52,31.5 180 top
R8  27.94,8.91 270 top
R9  29.24,8.91 270 top
R10  25.89,31.67 270 top
R11  29.39,31.67 90 top
R12  31.19,30.53 270 top
R13  11.44,42.97 0 top
R14  11.44,52.97 0 top
R15  8.36,55.77 0 top
R16  21.14,64.02 180 top
R17  31.87,77.71 0 top
R18  32.52,75.95 270 top
R19  65.76,22.54 180 top
R20  59.45,15.25 180 top
R21  53.96,32.77 0 top
RF1  14.89,34.72 90 top
TP2  56.37,15.9 0 top
TP5  29.59,28.66 180 top
U$1  28.02,37.6 0 top
U$2  18.99,47.97 270 bottom
U$7  40.43,23.42 270 top
U$13  41.45,63.13 0 top
U$14  32.72,53.87 0 top
ZW5  69.78,41.95 0 top

### Tracks (layer width: path | path; a pad name or v marks a point on that pad's centre or on a via)
GND  (via drill 0.5, 0.5 pad 0.75, 0.6, 0.6 pad 0.8, 0.6 pad 1.27, 0.7 pad 1.27)  (3 unrouted)
  Top 0.1: 55.64,21.53 55.64,23.24 55.03,23.24 C1.2
  Top 0.3: 55.64,21.53 IC1.19 | U$13.6 43.49,62.88 | 39.18,63.88 U$13.1 | C7.2 24.54,31.76 | 24.54,31.76 24.28,31.5 | 24.54,31.76 23.87,31.08 23.44,31.08 21.82,29.47 | R11.1 v28.01,31.02 | 21.82,29.47 21.09,28.74 | 21.82,29.47 v21.48,29.81 | 19.63,10.84 18.89,11.58 IC7.13 | 39.18,62.38 U$13.4 | 41.45,60.36 U$13.EP 41.45,66.9 39.77,66.9 | IC4.6 21.76,60.96 | 24.37,74.8 IC5.3 IC5.EP 27.26,75.3 IC5.9 30.68,75.3 | 30.68,75.3 30.69,75.3 | 30.68,75.3 R18.2 | IC2.12 IC2.11 | IC2.11 | IC2.10 64.4,29.97 | IC2.9 64.85,29.32 64.85,29.68 64.89,29.72 64.64,29.97 64.4,29.97 | 64.4,29.97 64.4,30.38 64.16,30.62 IC2.11 | IC2.8 55.85,29.32 55.37,28.84 | IC7.24 32.89,11.53 v32.93,11.49 | IC7.7 26.29,27.69 25.91,28.07 25.12,28.07 v24.39,28.8
  Top 0.5: C13.- IC5.EP C14.- | 21.09,28.74 IC7.10 | IC7.12 18.89,28.6 v18.52,28.97
  Bottom 0.3: v28.01,31.02 24.39,31.02 v24.39,28.8
  Bottom 0.4: U$2.5 14.95,46.67
  Bottom 0.406: 11.45,21.92 13.02,20.05 | 13.86,17.78 13.86,17.77 | 13.53,18.2 13.52,18.2
  other vias: 19.12,35.85 20.42,34.95 21.22,33.6 18.52,30.27 25.71,58.79 56.66,26.25 40.49,2.43 38.81,7.94 19.36,61.52 19.36,60.9 18.52,61.52 18.52,60.9 27.26,74.8 18.94,59.83 19.81,59.32 18.94,58.82 18.94,62.59 18.94,64.61 18.07,63.09 18.94,63.6 11.46,63.49 12.11,59.59 19.28,68.51 10.46,70.47 18.07,59.32 19.81,58.31 18.07,58.31 18.94,57.81 18.07,64.1 52.56,10.89 20.29,81.49
  pour Bottom (isolate 0.3): -19.58,104.55 -19.58,-16.7 125.65,-16.7 125.65,104.55
  pour Top (isolate 0.3, rank 6): -19.58,104.55 -19.58,-16.7 125.65,-16.7 125.65,104.55
  pour Top (isolate 0.3, no thermals): 21.09,24.77 18.89,24.77 18.89,28.02 8.94,28.02 8.94,40.86 21.09,40.86
GND_ANT  (2 unrouted)
N$1
  Top 0.3: U$13.8 44.49,63.88 45.73,62.64 46.28,62.64 | R6.2 64.16,33 63.73,32.57 IC2.14 62.01,32.57 61.62,32.96 61.62,36.37 64.11,38.86 64.11,54.36 61.61,56.86 | 46.28,62.64 55.82,62.64 61.61,56.86 | 46.28,62.64 | 61.61,56.86 61.62,56.84
N$2  (via drill 0.6 pad 1.27)
  Top 0.3: 30.69,74.3 IC5.7 | 30.69,74.3 30.69,74.68 | 30.69,74.68 | IC5.8 30.69,74.8 30.69,74.68 | v31.46,73.53 30.69,74.3 | IC5.5 25.13,73.8 24.21,72.88 C14.+ | C8.1 IC3.3
  Top 0.7: v24.21,67.77 23.1,66.66 16.5,66.66 14.93,65.09 C8.1 D4.C 8.65,62.08 7.7,61.13 Q3.2
  Top 0.8: v24.21,67.77 C14.+
  Bottom 0.3: v31.46,73.53 29.97,73.53 v24.21,67.77
N$3  (via drill 0.6 pad 1.27)
  Top 0.3: IC2.4 56.17,31.92 55.32,32.77 R21.2 v54.61,34.62 | v44.5,21.53 IC1.2
  Bottom 0.3: v54.61,34.62 44.5,24.51 v44.5,21.53
N$4  (via drill 0.7 pad 1.68)
  Top 0.3: R20.1 60.81,15.25 60.96,15.4 v63.83,15.4
  Bottom 0.3: ZW5.36 69.67,22.9 64.67,17.9 64.67,16.24 v63.83,15.4
N$5
  Top 0.3: Q4.B 64.81,21.42 65.11,21.72 R19.2
N$6  (via drill 0.6 pad 1.27)
  Top 0.3: IC2.2 57.9,33.22 59.82,35.15 59.82,36.62 59.34,37.11 59.34,38.01 v60.45,39.13
  Bottom 0.3: 67.4,62.44 67.4,60.75 62.31,55.65 62.31,40.98 v60.45,39.13 | 67.4,62.44 67.4,62.43 | 67.4,62.44 ZW5.3
N$7
  Top 0.4: IC3.2 C9.1 7.7,71.35 8.12,71.77 10.97,71.77 11.6,71.15 D2.2
N$8  (via drill 0.6 pad 1.27)
  Top 0.3: IC1.4 42.77,20.23 v42.12,20.88
  Bottom 0.3: v42.12,20.88 U$7.4
N$10  (via drill 0.6 pad 1.27)
  Top 0.3: v60.42,37.56 60.42,34.9 58.1,32.57 IC2.3
  Bottom 0.3: v60.42,37.56 61.54,38.67 61.54,39.36 62.91,40.73 62.91,55.38 62.91,55.4 ZW5.5
N$11
  Top 0.3: IC1.11 54.95,16.33 55.38,15.9 TP2.PP 57.43,15.9 58.08,15.25 R20.2
N$13
  Top 0.3: U$13.7 44.14,63.38 45.48,62.04 55.57,62.04 63.51,54.11 63.51,39.11 61.02,36.62 61.02,32.71 61.81,31.92 IC2.13 63.73,31.92 64.16,31.5 R7.2
N$14  (via drill 0.6 pad 1.27)
  Top 0.3: v30.34,72.42 30.34,73.4 29.94,73.8 IC5.6 | IC1.9 44.55,16.98 42.35,14.78 v38.1,14.78
  Bottom 0.3: v30.34,72.42 29.64,71.71 28.94,71.71 25.3,68.07 25.3,61.46 22.39,58.55 22.39,56.62 28.05,50.96 28.05,44.59 36.94,35.7 36.94,17.93 38.1,16.78 v38.1,14.78
N$15  (via drill 0.6 pad 1.27)
  Top 0.3: IC1.1 R1.2 46.48,26.55 44.53,28.5 v42.12,28.5
  Bottom 0.3: v42.12,28.5 U$7.1
N$16
  Route5 0: 77.21,16.53 77.21,91.43 79.35,93.57
N$17
  Top 0.3: R19.1 67.37,22.54 69.55,20.36 ZW5.38
N$18
  Top 0.4: BZ1.- 64.71,12.7 65.76,13.74 Q4.C
N$19  (via drill 0.6 pad 1.27)
  Top 0.3: IC1.5 43.36,19.58 v42.12,18.34
  Bottom 0.3: v42.12,18.34 U$7.5
N$20  (via drill 0.6 pad 1.27)
  other vias: 66.68,46.47
N$23  (via drill 0.6 pad 1.27)
  Top 0.3: IC1.17 52.62,20.23 52.23,19.85 52.23,14.09 52.88,13.44 v55.53,13.44
  Bottom 0.3: v55.53,13.44 57.49,13.44 62.27,18.22 62.27,18.9 69.11,25.74 69.11,39.72 69.61,40.22 69.61,45.04 70.79,46.22 70.79,49.41 69.61,50.59 69.61,52.28 ZW5.11
N$24  (via drill 0.6 pad 1.27)
  Top 0.3: 55.24,18.28 IC1.14 | v59.45,17.83 58.46,17.83 58.01,18.28 55.24,18.28 | 55.24,18.28
  Bottom 0.3: v59.45,17.83 61.03,17.83 61.67,18.47 61.67,19.15 68.51,25.99 ZW5.21
N$25  (via drill 0.6 pad 1.27)
  Top 0.3: IC1.15 55.04,18.93 55.03,18.92 v60.58,18.92
  Bottom 0.3: v60.58,18.92 67.91,26.24 67.91,39.72 67.4,40.23 67.4,41.14 68.51,42.25 ZW5.19
N$26
  Top 0.3: R3.2 43.28,14.86 44.75,16.33 IC1.10
N$27
  Top 0.3: IC1.12 57.61,16.98 58.45,16.15 60.2,16.15 62.27,18.22 62.27,19.62 58.88,23 58.88,30.48 58.09,31.27 IC2.5 R4.2
N$28  (via drill 0.6 pad 1.27)
  Top 0.3: C2.1 R3.1 R2.1 v40.6,10.96
  Bottom 0.3: U$1.1 22.9,40.21 10.02,40.21 8.83,39.02 8.83,30.38 32.12,7.09 32.12,6.52 32.5,6.14 34.47,6.14 39.29,10.96 v40.6,10.96
N$30
  Route5 0: 53.26,74.45 53.26,74.57 53.23,74.6
N$31
  Top 0.3: U$13.2 39.26,63.38 39.26,62.88 | 39.26,62.88 U$13.3 | 39.26,62.88 C12.1 35.32,62.88 31.47,59.03 U$14.+ | IC4.4 15.76,60.47 15.51,60.72 15.76,60.97 IC4.3
  Top 0.5: 15.51,60.72 14.95,60.72 14.49,60.26 C11.1
  Top 1: 14.49,57.67 C11.1 | 14.49,57.67 18.29,53.87 U$14.+ | 14.49,57.67 Q3.3
N$32
  Route5 0: 50.66,74.45 50.76,74.45 50.76,74.56
N$33
  Route5 0: 80.56,66.93 80.56,67.05 80.53,67.08
N$35
  Route5 0: 77.96,66.93 78.06,66.93 78.06,67.04
N$36
  Top 0.3: R14.1 LED1.A
N$37
  Top 0.3: IC1.13 57.81,17.63 58.7,16.75 59.95,16.75 61.67,18.47 61.67,19.37 58.28,22.75 58.28,30.23 57.89,30.62 IC2.6 56.17,30.62 55.32,29.77 R5.2
N$38
  Top 0.3: R13.1 LED3.A
N$39  (via drill 0.6 pad 1.27, 0.7 pad 1.27)
  Top 0.3: R7.1 R6.1 66.17,33.81 65.79,34.2 65.17,34.2 64.87,34.5 | R2.2 38.59,12.65 37.01,14.22 37.01,24.23 v38.74,25.96 38.74,28.52 39.98,29.76 | 64.87,34.5 C3.1 v63.58,36 | IC2.16 63.73,33.87 64.05,34.2 64.57,34.2 64.87,34.5 | R21.1 R4.1 R5.1 v53.31,28.39 53.31,25.7 53.73,25.27 C1.1
  Top 0.4: IC1.20 C1.1 R1.1 47.78,26.17 44.19,29.76 39.98,29.76 39.98,31.02 26.97,44.03 v26.97,45.62 | D2.3 v14.28,66.54
  Bottom 0.3: v38.74,25.96 U$7.2 | v63.58,36 55.97,28.39 v53.31,28.39
  Bottom 0.4: v26.97,45.62 26.97,46.62 27.4,47.05 27.4,50.69 21.96,56.13 17.66,56.13 16.07,57.72 16.07,64.75 v14.28,66.54
N$40  (via drill 0.6 pad 1.27)
  Top 0.3: IC4.5 21.12,60.46 v23.48,58.1 | v39.86,15.86 40.85,15.86 41.33,15.38 42.1,15.38 44.35,17.63 IC1.8
  Bottom 0.3: v23.48,58.1 23.48,56.38 28.65,51.21 28.65,44.84 37.54,35.95 37.54,18.18 v39.86,15.86
N$41  (via drill 0.6 pad 1.27)
  Top 0.3: v13.61,42.97 R13.2 | IC1.7 47.6,18.28 47.98,17.9 47.98,15.5 49.43,14.05 v49.43,11.24
  Bottom 0.3: v13.61,42.97 11.93,42.97 8.23,39.27 8.23,30.13 31.52,6.84 31.52,6.27 32.25,5.54 41.59,5.54 44.96,8.91 48.47,8.91 49.43,9.87 v49.43,11.24
N$48
  Route5 0: 36.49,54.03
N$49
  Top 0.3: IC5.10 31.01,75.9 31.71,76.6 R18.1 R17.2
N$51  (via drill 0.6 pad 1.27)
  Top 0.3: v12.09,51.6 R14.2 | 48.43,18.3 48.58,18.15 48.58,15.75 50.03,14.3 50.03,12.18 50.52,11.69 v50.52,10.11 | 48.43,18.3 48.41,18.32 | IC1.6 47.8,18.93 48.43,18.3
  Bottom 0.3: v12.09,51.6 10.55,50.06 10.55,42.44 7.63,39.52 7.63,29.88 30.92,6.59 30.92,6.02 32,4.94 41.84,4.94 45.21,8.31 48.72,8.31 v50.52,10.11
N$52
  Route5 0: 36.52,54.05 36.49,54.05 36.49,54.04
N$53
  Route5 0: 36.56,53.97 36.49,53.97 36.49,54.01
N$54
  Route5 0: 74.06,41.5 74.06,41.97 74.4,41.97
N$56
  Route5 0: 95.99,45.73 95.99,47.97 76.06,47.97
N$59
  pour Top: 25.23,73.8 25.04,73.8 23.39,72.15 23.39,71.15 25.04,71.15 25.02,72.89 25.23,73.1
N$61
  Top 0.3: 24,75.64 23.83,75.47 23.99,75.3 IC5.2
  Top 0.8: 24.09,75.56 24,75.64 22.05,77.6 L2.2
  pour Top (no thermals): 22.22,76.85 15.03,76.85 15.03,79.35 22.22,79.35
N$62
  Top 0.3: 23.95,73.91 23.78,74.09 23.99,74.3 IC5.4
  Top 0.8: 24.08,74.04 23.95,73.91 22.04,72 L2.1
  pour Top (no thermals): 22.22,72.65 15.03,72.65 15.03,70.25 22.22,70.25
N$65
  Route5 0: 21.09,24.77 18.89,24.77 18.89,28.02 8.94,28.02 8.94,40.86 21.09,40.86 21.09,24.77
N$66  (2 unrouted)
  Top 1.08: RF1.1 17.44,34.72 arc-90 19.99,32.17 19.99,27.64
N$67
  Top 0.3: Q1.3 25.98,33.92 25.83,33.77 C7.1 23.63,33.77 22.98,33.13 22.98,32.34 22.3,31.66 L1.1
N$68
  Top 0.3: Q1.2 27.59,33.42 27.29,33.12 27.12,33.12 26.94,32.95 Q1.4 R10.1
N$69
  Top 0.3: Q1.5 Q1.6 R11.2
N$70
  Top 0.3: Q1.1 30.47,33.92 31.19,33.2 R12.1
N$71
  Top 0.3: IC7.4 TP5.PP
N$72  (via drill 0.6 pad 1.27)
  Top 0.3: v26.92,28.8 25.93,28.8 24.85,29.88 23.94,29.88 23.29,29.24 IC7.8
N$73
  Top 0.3: R9.1 29.24,10.48 29.59,10.83 IC7.21
N$74
  Top 0.3: R8.1 27.94,10.47 28.49,11.02 IC7.20
N$75
  Top 0.3: R12.2 26.32,29.88 25.89,30.31 R10.2 25.08,31.02 24.54,30.48 23.69,30.48 22.19,28.99 IC7.9
N$76  (via drill 0.6 pad 1.27)
  Top 0.3: v27.94,6.97 R8.2
  Bottom 0.3: v27.94,6.97 29.69,6.97 30.32,6.34 30.32,5.77 31.75,4.34 42.09,4.34 45.46,7.71 48.97,7.71 50.28,9.02 53.5,9.02 56.72,12.24 57.99,12.24 63.47,17.72 63.47,18.4 70.31,25.24 70.31,39.22 70.81,39.72 70.81,44.54 71.99,45.72 71.99,49.91 71.65,50.25 71.65,52.42 72.15,52.93 72.15,54.82 ZW5.10
N$77  (via drill 0.6 pad 1.27)
  Top 0.3: v29.24,5.89 R9.2
  Bottom 0.3: v29.24,5.89 31.5,3.74 42.34,3.74 45.71,7.11 49.22,7.11 50.53,8.42 53.75,8.42 56.97,11.64 58.24,11.64 64.07,17.47 64.07,18.15 70.91,24.99 70.91,38.97 71.41,39.47 71.41,44.29 72.59,45.47 72.59,50.16 72.25,50.5 72.25,52.17 72.75,52.68 72.75,55.07 72.15,55.67 72.15,57.36 ZW5.8
N$78
  Route6 0: -19.58,104.55 -19.58,-16.7 125.65,-16.7 125.65,104.55 -19.58,104.55
N$80  (via drill 0.6 pad 1.27)  (1 unrouted)
  Top 0.3: IC1.16 54.84,19.58 54.85,19.58 58.04,19.58 58.46,20 v59.45,20 | v66.67,41.95 66.67,46.47
  Bottom 0.3: v59.45,20 60.82,20 67.31,26.49 67.31,39.47 66.67,40.11 v66.67,41.95 | ZW5.13 66.67,49.01 66.67,46.47
N$81  (via drill 0.6 pad 1.27)
  Top 0.3: IC1.18 52.42,20.88 51.63,20.1 51.63,13.84 52.63,12.84 52.92,12.84 53.41,12.36 v54.39,12.36
  Bottom 0.3: v54.39,12.36 55.98,12.36 56.47,12.84 57.74,12.84 62.87,17.97 62.87,18.65 69.71,25.49 69.71,39.47 70.21,39.97 70.21,44.79 71.39,45.97 71.39,49.66 71.05,50 ZW5.12
N$82
  Top 0.3: IC4.8 21.4,61.96 21.79,62.35 R16.1
N$83  (via drill 0.6 pad 1.27, 0.7 pad 1.42)  (2 unrouted)
  Top 0: 16.23,61.71 16.14,61.71
  Top 0.3: IC4.2 16.48,61.46 16.23,61.71 16.48,61.96 IC4.1 | 4.37,55.77 R15.1 | Q3.1 9.6,61.71 v10.63,61.71
  Top 0.5: 16.14,61.71 C10.1 | 5.11,57.67 5.1,57.67
  Top 0.8: C10.1 v11.9,61.71 v10.63,61.71
  Top 1: v15.11,49.27 v13.68,49.27 | 13.66,49.27 6.63,49.27 4.37,51.53 4.37,55.77 4.37,56.94 5.11,57.67 v5.11,59.57 5.11,63.34 D4.A
  Bottom 0.4: U$2.1 15.99,49.27
  Bottom 0.8: v5.11,59.57 v5.11,61.71 v11.9,61.71
  Bottom 1: v15.11,49.27 13.66,49.27
  Bottom 1.016: 15.13,49.27 15.99,49.27
N$84
  Route5 0: 76.26,16.45 76.26,16.57 76.23,16.6
N$85
  Route5 0: 73.66,16.45 73.76,16.45 73.76,16.56
N$86
  Route5 0: 49.28,12.95 49.28,13.07 49.25,13.1
N$87
  Route5 0: 46.68,12.95 46.78,12.95 46.78,13.06
N$89
  Route5 0: 47.57,70.72 49.28,70.72 49.46,70.9
N$90
  Route5 0: 47.99,65.97 44.54,65.97 | 47.99,65.97 37.73,65.94 38.45,65.22 | 47.99,65.97 47.99,65.63 47.91,65.55
N$91
  Route5 0: 6.49,37.93 6.49,38.19 6.48,38.21
N$92
  Route5 0: 3.99,36.97 0.54,36.97 | 7.5,36.97 3.99,36.97 | 3.99,36.97 3.99,36.63 3.91,36.55
N$93
  Route5 0: 50.49,3.93 50.49,4.2 50.48,4.21
N$94
  Route5 0: 47.99,2.98 44.54,2.98 | 51.5,2.98 47.99,2.98 | 47.99,2.98 47.99,2.64 47.91,2.56
N$95
  Route5 0: 67.99,4.29 67.99,4.35 24.55,4.35 24.55,-4.03
N$96
  Route5 0: 6.75,36.97 5.99,36.97 5.99,39.23
N$97
  Route5 0: 27.99,4.44 27.99,3.95 27.97,3.93
N$98
  Route5 0: 30.89,98.12 30.89,96.2 30.31,96.2
N$107
  Route5 0: 18.36,85.8 18.36,85.72 18.29,85.72
VCC  (via drill 0.6 pad 1.27, 0.7 pad 1.27)
  Top 0.3: v29.93,77.71 R17.1 | IC5.1 25.21,75.9 24.21,76.9 C13.+
  Top 0.5: C13.+ v24.21,81.83
  Bottom 0.5: v24.21,81.83 25.81,81.83 v29.93,77.71 34.95,77.71 37.05,75.6 55.71,75.6 64.02,67.29 69.84,67.29 ZW5.2 ZW5.4
  pour Top: 25.29,75.9 24.95,75.9 23.39,77.47 23.39,78.48 25.04,78.48 25.04,76.49 25.29,76.23
VDD  (via drill 0.6 pad 1.27, 0.7 pad 1.27, 0.8 pad 1.27)
  Top 0.3: C6.1 31.89,8.34 31.79,8.44 31.79,9.02 v31.24,9.57 | C5.1 30.59,8.34 30.69,8.44 30.69,9.02 v31.24,9.57 | v31.24,9.57 30.69,10.12 IC7.22 | v31.24,9.57 31.79,10.12 IC7.23
  Top 0.4: v31.23,9.57 v31.24,9.57 C4.1 35.14,9.57 38.5,6.21 54.23,6.21 BZ1.+ | D2.1 13.5,71.59 12.86,72.22 12.86,78.11 18.59,83.84 29.94,83.84 34.46,79.31 v34.46,76.52 | v68.51,45.76 68.51,48.47 66.53,50.44 66.53,64.11 ZW5.1
  Bottom 0.4: v31.24,9.57 33.69,9.57 37.46,13.34 39.89,13.34 42.33,15.78 50.27,15.78 64.8,30.31 64.8,42.05 v68.51,45.76 | v34.46,76.52 35.17,75.81 35.79,75.81 36.74,74.85 55.4,74.85 63.71,66.54 67.01,66.54 67.47,66.08 ZW5.1

### Text on the board
Top: BATT | 3_2B4c | 2019
tNames: L2 | IC5 | ZW1 | IC4 | IC6 | J1 | ZW2 | ZW3 | ver.3_2b4b | J2 | ZW4 | J4 | ZW5 | D3
vRestrict: ver.3_2b4c | Modifiche: | - aggiunto buzzer | - aggiunto connettore 3 pin per pulsante | - collegata VDD tra i 2 pin del Raspberry per alimentazione GPS